# Altium project Dendro_hardware.PrjPcb
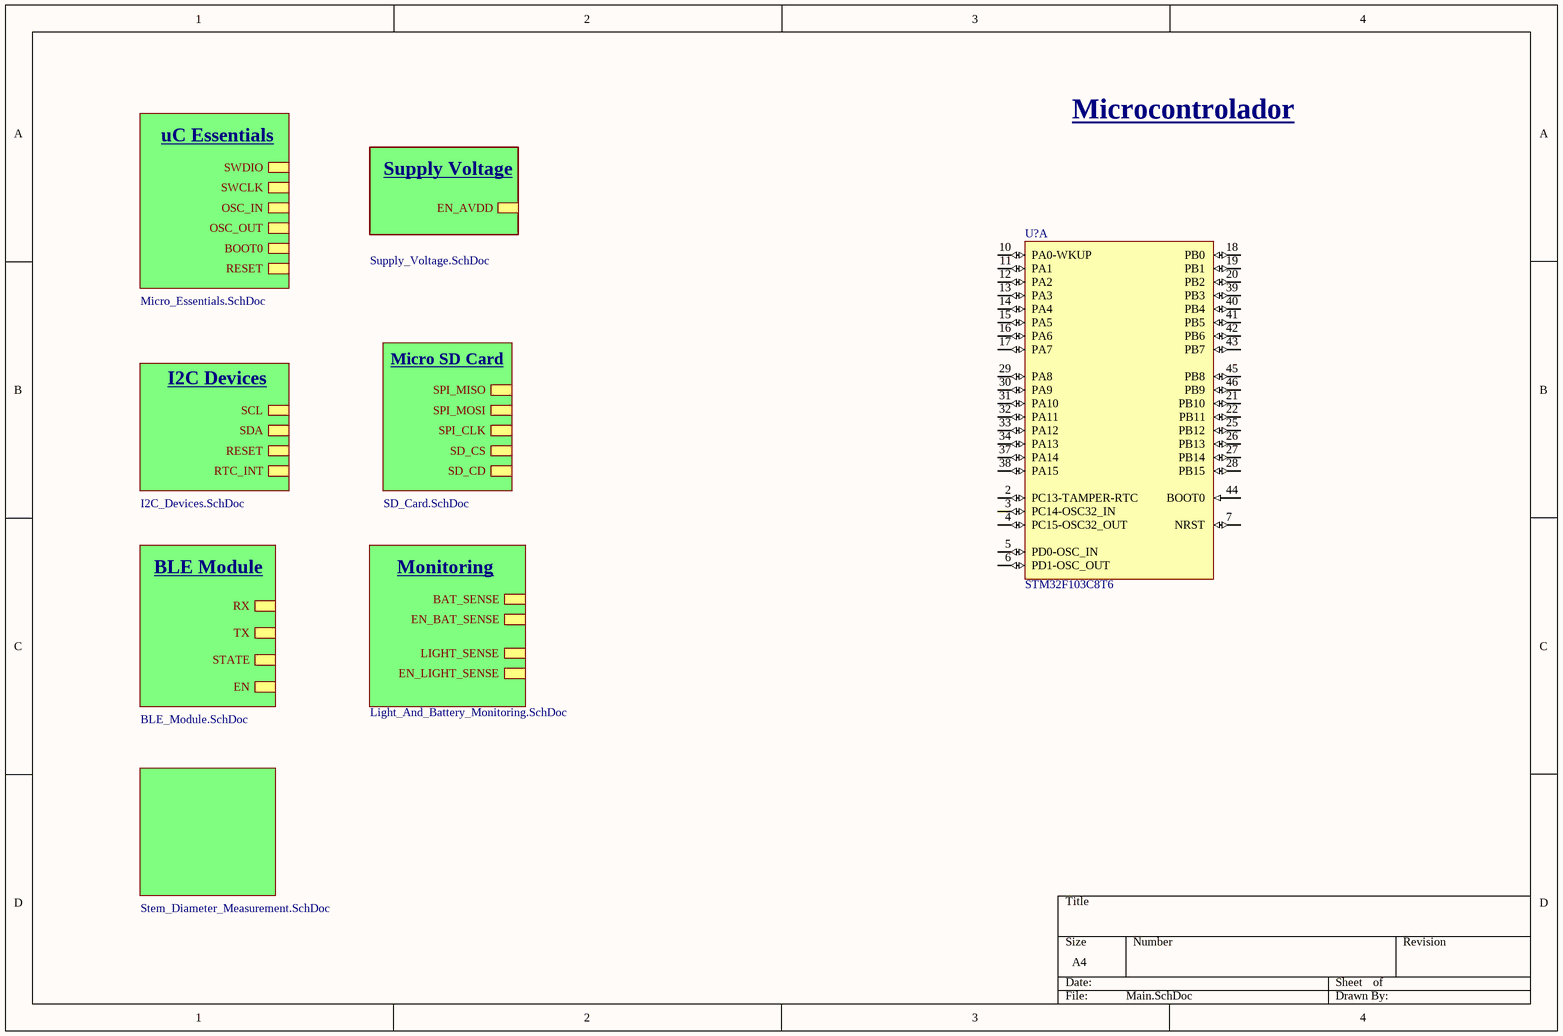
[diagram p0: Main.SchDoc]
8 sheets, 76 parts. Net scope: hierarchical (ports join the sheet entries above them; power ports are global).
Sheets:
  Main.SchDoc
    Micro_Essentials = Micro_Essentials.SchDoc
    Supply_Voltage = Supply_Voltage.SchDoc
    Real_Time_Clock = I2C_Devices.SchDoc
    SD_Card = SD_Card.SchDoc
    BLE_Module = BLE_Module.SchDoc
    Light_And_Battery_Monitoring = Light_And_Battery_Monitoring.SchDoc
    Stem_Diameter_Measurement = Stem_Diameter_Measurement.SchDoc

## Sheet Main.SchDoc
size A4; SheetNumber: 1; SheetTotal: 8

### Parts
(Parts that share a designator on the sheet are numbered #1, #2 ... from top to bottom, then left to right.)
U?#1  STM32F103C8T6  [STM-LQFP48_L]  (part A of 2)

### Sub-sheets
BLE_Module = BLE_Module.SchDoc: RX, TX, STATE, EN  | Titulo: BLE Module
Light_And_Battery_Monitoring = Light_And_Battery_Monitoring.SchDoc: BAT_SENSE, EN_BAT_SENSE, LIGHT_SENSE, EN_LIGHT_SENSE  | Titulo: Monitoring
Micro_Essentials = Micro_Essentials.SchDoc: RESET, BOOT0, OSC_OUT, OSC_IN, SWCLK, SWDIO  | Titulo: uC Essentials
Real_Time_Clock = I2C_Devices.SchDoc: SCL, SDA, RESET, RTC_INT  | Titulo: I2C Devices
SD_Card = SD_Card.SchDoc: SPI_MISO, SPI_MOSI, SPI_CLK, SD_CD, SD_CS  | Titulo: Micro SD Card
Stem_Diameter_Measurement = Stem_Diameter_Measurement.SchDoc: no entries
Supply_Voltage = Supply_Voltage.SchDoc: EN_AVDD  | Titulo: Supply Voltage

### Nets

Not connected (* = marked no-connect by the designer): U?#1 2(PC13-TAMPER-RTC) 3(PC14-OSC32_IN) 4(PC15-OSC32_OUT) 5(PD0-OSC_IN) 6(PD1-OSC_OUT) 7(NRST) 10(PA0-WKUP) 11(PA1) 12(PA2) 13(PA3) 14(PA4) 15(PA5) 16(PA6) 17(PA7) 18(PB0) 19(PB1) 20(PB2) 21(PB10) 22(PB11) 25(PB12) 26(PB13) 27(PB14) 28(PB15) 29(PA8) 30(PA9) 31(PA10) 32(PA11) 33(PA12) 34(PA13) 37(PA14) 38(PA15) 39(PB3) 40(PB4) 41(PB5) 42(PB6) 43(PB7) 44(BOOT0) 45(PB8) 46(PB9)

### Notes on the sheet
- Microcontrolador

### Library data of the parts
U?#1 = CMP-0237-00215-3: ARM Cortex-M3 32-bit MCU, 64 KB Flash, 20 KB Internal RAM, 37 I/Os, 48-pin LQFP, -40 to 85 degC, Tray; Supply Voltage(Vcc) min (V): 2; Internal RAM Size (kB): 20; FLASH Size (Prog) (kB): 64; A/D Converter: 2x12-bit (10 Channel); I/Os (High Current): 37; Operating Frequency(F) (Processor speed) (MHz): 72; Core: ARM Cortex-M3; ComponentLink3Description: Package Specification; Mounting Technology: Surface Mount; PartNumber: STM32F103C8T6; PackageReference: LQFP48; Packing: Tray; ComponentLink3URL: http://www.st.com/st-web-ui/static/active/en/resource/technical/document/datasheet/DM00058181.pdf; DatasheetVersion: Rev. 16; ComponentLink1URL: http://www.st.com/web/en/home.html; PackageVersion: Rev. 6, 06/2013; ComponentLink2URL: http://www.st.com/st-web-ui/static/active/en/resource/technical/document/datasheet/CD00161566.pdf; ComponentLink1Description: Manufacturer URL; ComponentLink2Description: Datasheet; PackageDescription: 48-Pin Low Profile Quad Flat Package, 7 x 7 mm Body, 0.5 mm Pitch

## Sheet Micro_Essentials.SchDoc
size A4; SheetNumber: 3; SheetTotal: 8
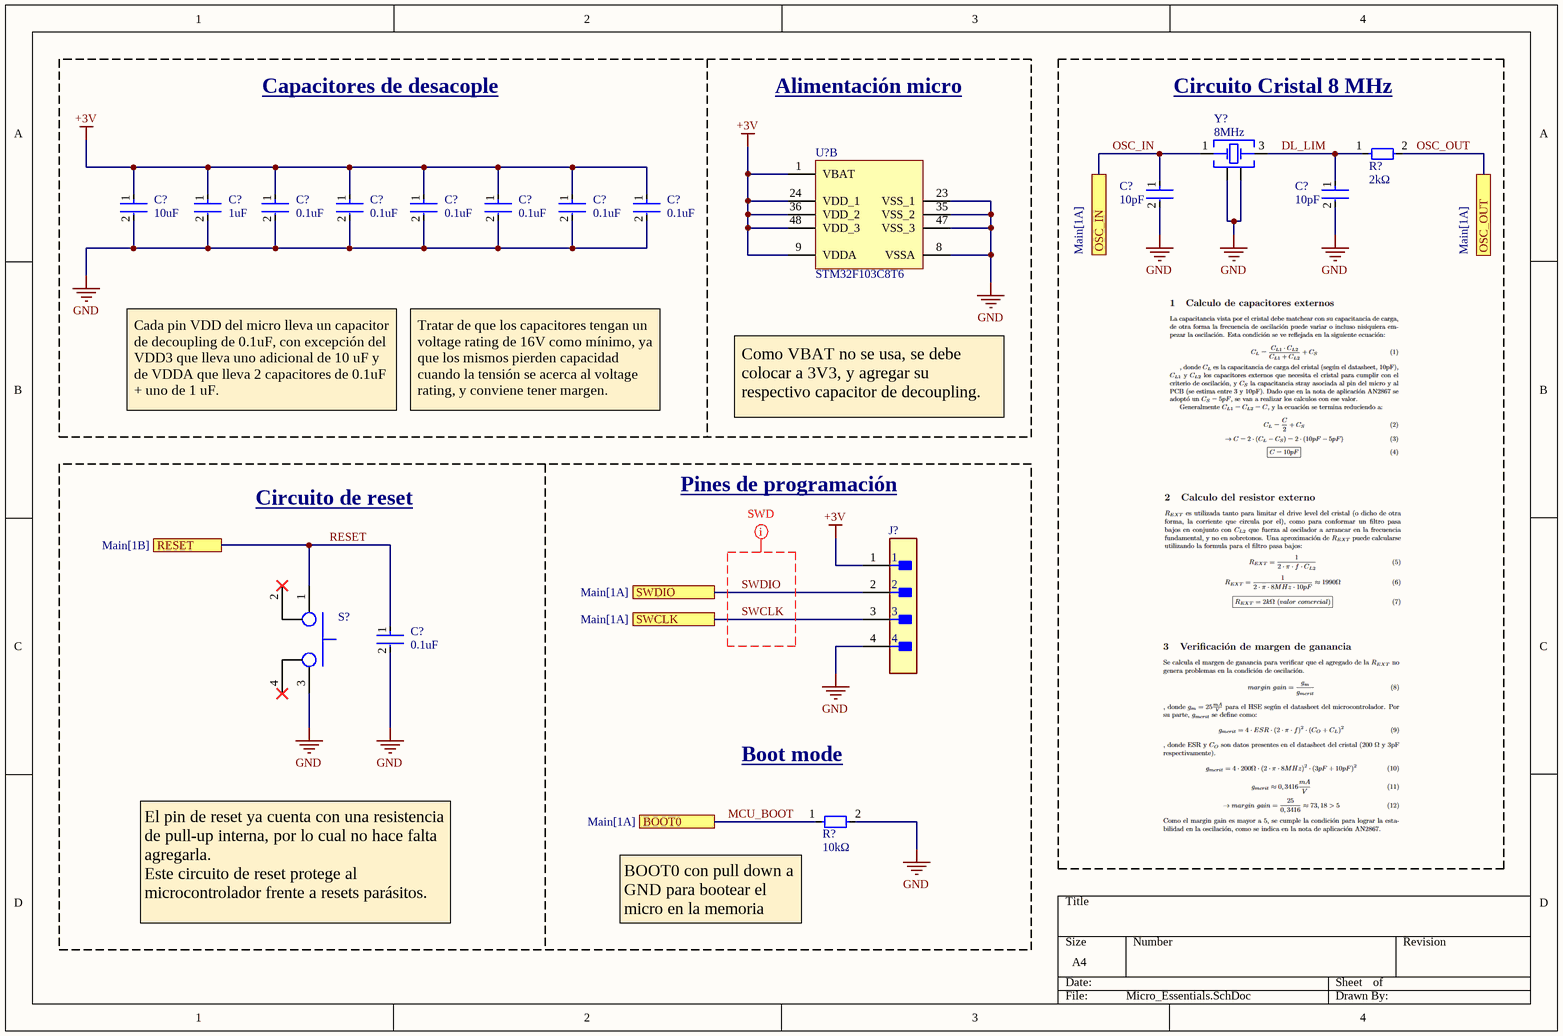
[diagram p1: Micro_Essentials.SchDoc]

### Parts
(Parts that share a designator on the sheet are numbered #1, #2 ... from top to bottom, then left to right.)
C?#1  Capacitance: 10pF  [FP-CL21-IPC_C]
C?#2  Capacitance: 10pF  [FP-CL21-IPC_C]
C?#3  Capacitance: 10uF  [FP-CL21-IPC_B]  (hidden comment: CL21A106KPFNNNE)
C?#4  Capacitance: 1uF  [FP-CL21-IPC_C]  (hidden comment: CL21B105KAFNNNG)
C?#5  Capacitance: 0.1uF  [FP-CL21-IPC_C]
C?#6  Capacitance: 0.1uF  [FP-CL21-IPC_C]
C?#7  Capacitance: 0.1uF  [FP-CL21-IPC_C]
C?#8  Capacitance: 0.1uF  [FP-CL21-IPC_C]
C?#9  Capacitance: 0.1uF  [FP-CL21-IPC_C]
C?#10  Capacitance: 0.1uF  [FP-CL21-IPC_C]
C?#11  Capacitance: 0.1uF  [FP-CL21-IPC_C]
J?#1  HTSW-104-07-G-S  [FP-HTSW-104-07-G-S-MFG]  (value not drawn)
R?#1  value 2kΩ  [PACKAGE_0805]  (hidden comment: Simbolo de resistencia genérica)
R?#2  value 10kΩ  [PACKAGE_0805]  (hidden comment: Simbolo de resistencia genérica)
S?  Tactile push button  [FP-B3W-1000-MFG]  (value not drawn)
U?#2  STM32F103C8T6  [STM-LQFP48_L]  (part B of 2)
Y?  Frequency: 8MHz  [WE-XTAL_12SMX]  (hidden comment: 830059082)

### Blocks framed on the sheet
Circuito Cristal 8 MHz: C?#1 C?#2 R?#1 Y?

### Ports
BOOT0 (see Main[1A]), OSC_IN (see Main[1A]), OSC_OUT (see Main[1A]), RESET (see Main[1B]), SWCLK (see Main[1A]), SWDIO (see Main[1A])

### Nets
+3V: C?#3.1 C?#4.1 C?#5.1 C?#6.1 C?#7.1 C?#8.1 C?#9.1 C?#10.1 J?#1.1 U?#2.1(VBAT) U?#2.9(VDDA) U?#2.24(VDD_1) U?#2.36(VDD_2) U?#2.48(VDD_3)
GND: C?#1.2 C?#2.2 C?#3.2 C?#4.2 C?#5.2 C?#6.2 C?#7.2 C?#8.2 C?#9.2 C?#10.2 C?#11.2 J?#1.4 R?#2.2 S?.3 U?#2.8(VSSA) U?#2.23(VSS_1) U?#2.35(VSS_2) U?#2.47(VSS_3) Y?.2(GND_&_Lid) Y?.4(GND_&_Lid)
DL_LIM: C?#2.1 R?#1.1 Y?.3(Crystal)
MCU_BOOT: R?#2.1 ; port BOOT0
OSC_IN: C?#1.1 Y?.1(Crystal) ; port OSC_IN
OSC_OUT: R?#1.2 ; port OSC_OUT
RESET: C?#11.1 S?.1 ; port RESET
SWCLK: J?#1.3 ; port SWCLK
SWDIO: J?#1.2 ; port SWDIO

Not connected (* = marked no-connect by the designer): S? 2* 4*

### Layout directives
net class SWD: SWCLK, SWDIO

### Notes on the sheet
- Capacitores de desacople
- Alimentación micro
- Cada pin VDD del micro lleva un capacitor de decoupling de 0.1uF, con excepción del VDD3 que lleva uno adicional de 10 uF y de VDDA que lleva 2 capacitores de 0.1uF + uno de 1 uF.
- Tratar de que los capacitores tengan un voltage rating de 16V como mínimo, ya que los mismos pierden capacidad cuando la tensión se acerca al voltage rating, y conviene tener margen.
- Como VBAT no se usa, se debe colocar a 3V3, y agregar su respectivo capacitor de decoupling.
- Circuito de reset
- Pines de programación
- Boot mode
- El pin de reset ya cuenta con una resistencia de pull-up interna, por lo cual no hace falta agregarla.
  Este circuito de reset protege al microcontrolador frente a resets parásitos.
- (near R?#2) BOOT0 con pull down a GND para bootear el micro en la memoria flash principal.

### Library data of the parts
C?#1 C?#2 C?#5-C?#11 = CMP-13271-003813-1: 0805 0.1uF 25V ±10% Tolerance X7R Multilayer Ceramic Chip Capacitor; Case Code (Imperial): 0805; Length: 2mm; Max Operating Temperature: 125°C; Tolerance: 10%; Depth: 1.25mm; Package Quantity: 3000; Material: Ceramic; Voltage Rating: 25V; Height: 1.25mm; Mount: Surface Mount; Dielectric: X7R; Packaging: Tape and Reel; Voltage: 25V; Case/Package: 0805; Radiation Hardening: No; Thickness: 0.053inch; Width: 0.049inch; Min Operating Temperature: -55°C; Case Code (Metric): 2012
C?#3 = CMP-2000-06103-2: CL21 Series 0805 10uF 10V ±10% Tolerance X5R Multilayer Ceramic Chip Capacitor; Case Code (Imperial): 0805; Mount: Surface Mount; Depth: 1.25mm; Length: 2mm; Lead Free: Lead Free; Packaging: Tape and Reel; Dielectric: X5R; Width: 0.049inch; Package Quantity: 1; Height: 1.25mm; Case/Package: 0805; Voltage Rating: 10V; Thickness: 0.053inch; Max Operating Temperature: 85°C; Tolerance: 10%; Case Code (Metric): 2012; Contact Plating: Tin; Min Operating Temperature: -55°C; Radiation Hardening: No; Voltage Rating (DC): 10V
C?#4 = CMP-13271-003813-1: CL21 Series 0805 1uF 25V ±10% Tolerance X7R Multilayer Ceramic Chip Capacitor; Case Code (Imperial): 0805; Length: 2mm; Max Operating Temperature: 125°C; Tolerance: 10%; Depth: 1.25mm; Package Quantity: 3000; Material: Ceramic; Voltage Rating: 25V; Height: 1.25mm; Mount: Surface Mount; Dielectric: X7R; Packaging: Tape and Reel; Voltage: 25V; Case/Package: 0805; Radiation Hardening: No; Thickness: 0.053inch; Width: 0.049inch; Min Operating Temperature: -55°C; Case Code (Metric): 2012
J?#1 = CMP-02766-001776-1: CONN HEADER VERT 4POS 2.54MM; Gender: Male; Number of Contacts: 4; Packaging: Bulk; RoHS Compliant: Yes; Number of Rows: 1; Mount: Through Hole; Contact Material: Bronze; Series: HTSW; Radiation Hardening: No; Pitch: 2.54mm; Reach SVHC Compliant: Yes; Contact Plating: Gold; Termination: Through Hole
R?#1 R?#2 = Generic R
U?#2 = CMP-0237-00215-3: as U?#1 on sheet Main; Core: ARM Cortex-M3; ComponentLink3Description: Package Specification; Mounting Technology: Surface Mount; PartNumber: STM32F103C8T6; PackageReference: LQFP48; Packing: Tray; ComponentLink3URL: http://www.st.com/st-web-ui/static/active/en/resource/technical/document/datasheet/DM00058181.pdf; DatasheetVersion: Rev. 16; ComponentLink1URL: http://www.st.com/web/en/home.html; PackageVersion: Rev. 6, 06/2013; ComponentLink2URL: http://www.st.com/st-web-ui/static/active/en/resource/technical/document/datasheet/CD00161566.pdf; ComponentLink1Description: Manufacturer URL; ComponentLink2Description: Datasheet; PackageDescription: 48-Pin Low Profile Quad Flat Package, 7 x 7 mm Body, 0.5 mm Pitch
Y? = CMP-03913-116855696-1: 830059082 WE-XTAL Quartz Crystal; Length: 7mm; Min Operating Temperature: -20°C; NexarPartId: 116855696; Max Operating Temperature: 70°C; Width: 5mm; Height: 1.4mm

## Sheet Supply_Voltage.SchDoc
size A4; SheetNumber: 2; SheetTotal: 8
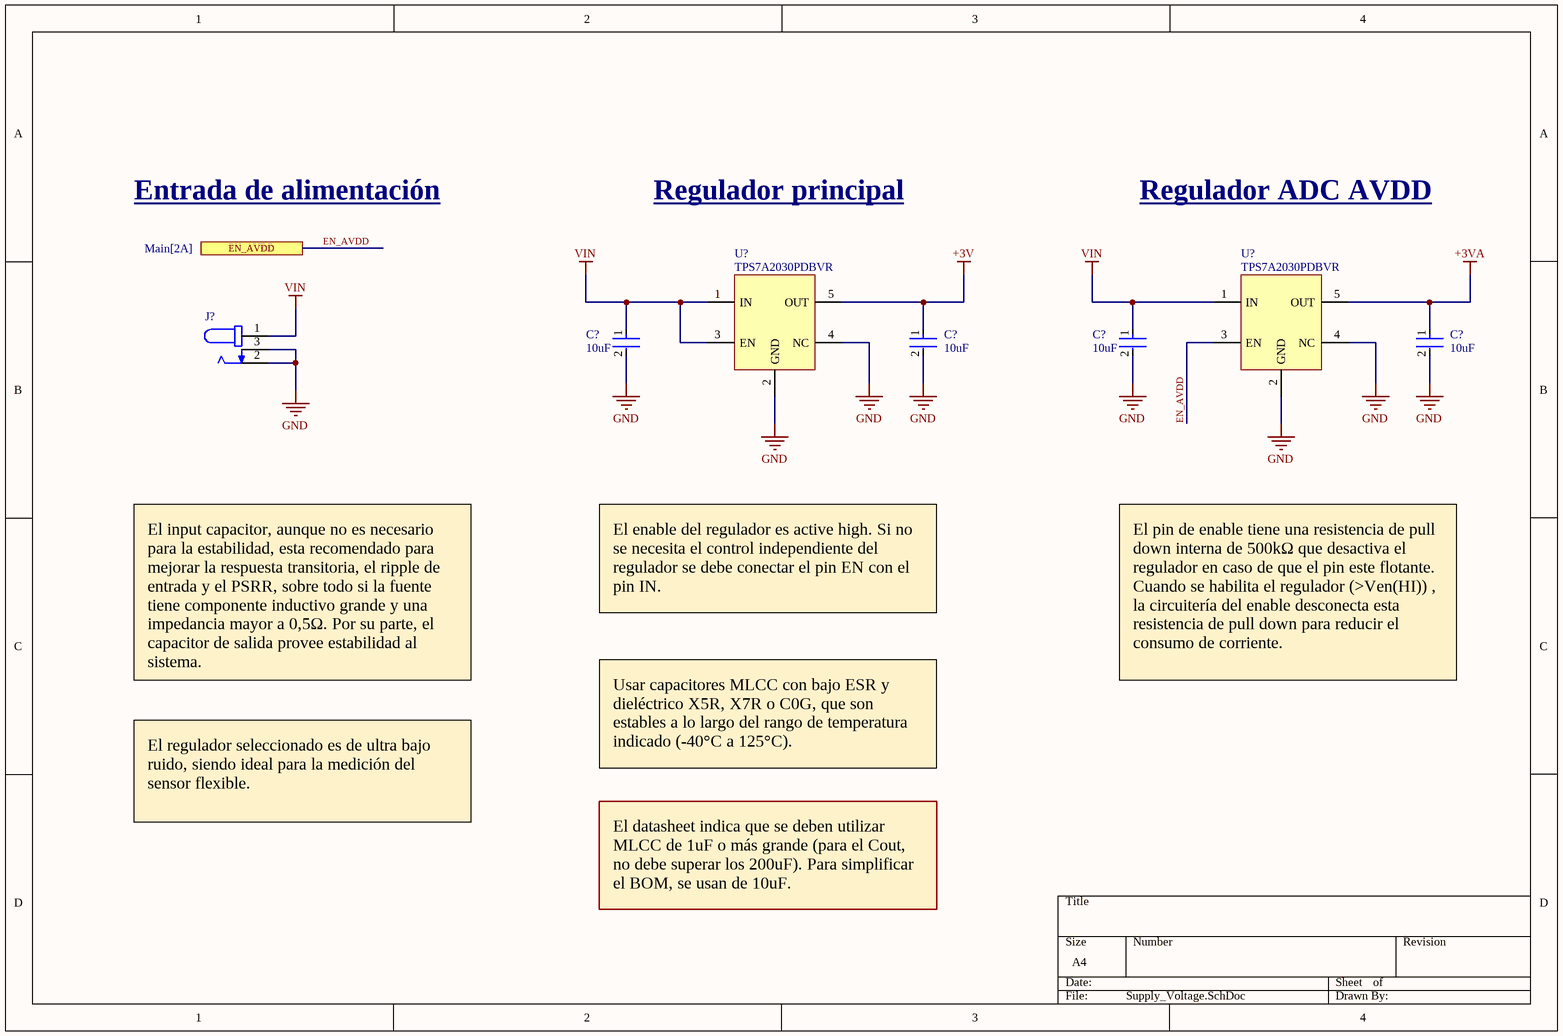
[diagram p2: Supply_Voltage.SchDoc]

### Parts
(Parts that share a designator on the sheet are numbered #1, #2 ... from top to bottom, then left to right.)
C?#12  Capacitance: 10uF  [FP-CL21-IPC_B]  (hidden comment: CL21A106KPFNNNE)
C?#13  Capacitance: 10uF  [FP-CL21-IPC_B]  (hidden comment: CL21A106KPFNNNE)
C?#14  Capacitance: 10uF  [FP-CL21-IPC_B]  (hidden comment: CL21A106KPFNNNE)
C?#15  Capacitance: 10uF  [FP-CL21-IPC_B]  (hidden comment: CL21A106KPFNNNE)
J?#2  DCJ200-10-A-XX-K_REVA  [GCT_DCJ200-10-A-XX-K_REVA]  (value not drawn)
U?#3  TPS7A2030PDBVR  [SOT-23 Texas]
U?#4  TPS7A2030PDBVR  [SOT-23 Texas]

### Ports
EN_AVDD (see Main[2A])

### Nets
+3V: C?#13.1 U?#3.5(OUT)
+3VA: C?#15.1 U?#4.5(OUT)
GND: C?#12.2 C?#13.2 C?#14.2 C?#15.2 J?#2.2 J?#2.3 U?#3.2(GND) U?#3.4(NC) U?#4.2(GND) U?#4.4(NC)
VIN: C?#12.1 C?#14.1 J?#2.1 U?#3.1(IN) U?#3.3(EN) U?#4.1(IN)
EN_AVDD: U?#4.3(EN) ; port EN_AVDD

### Notes on the sheet
- Entrada de alimentación
- Regulador principal
- Regulador ADC AVDD
- El enable del regulador es active high. Si no se necesita el control independiente del regulador se debe conectar el pin EN con el pin IN.
- El input capacitor, aunque no es necesario para la estabilidad, esta recomendado para mejorar la respuesta transitoria, el ripple de entrada y el PSRR, sobre todo si la fuente tiene componente inductivo grande y una impedancia mayor a 0,5Ω. Por su parte, el capacitor de salida provee estabilidad al sistema.
  Ambos capacitores deben ser de 1uF o mayores. En este caso se elige 10uF para simplificar el BOM.
- El pin de enable tiene una resistencia de pull down interna de 500kΩ que desactiva el regulador en caso de que el pin este flotante. Cuando se habilita el regulador (>Ven(HI)) , la circuitería del enable desconecta esta resistencia de pull down para reducir el consumo de corriente.
- Usar capacitores MLCC con bajo ESR y  dieléctrico X5R, X7R o C0G, que son estables a lo largo del rango de temperatura indicado (-40°C a 125°C).
- El regulador seleccionado es de ultra bajo ruido, siendo ideal para la medición del sensor flexible.
- El datasheet indica que se deben utilizar MLCC de 1uF o más grande (para el Cout, no debe superar los 200uF). Para simplificar el BOM, se usan de 10uF.

### Library data of the parts
C?#12-C?#15 = CMP-2000-06103-2: as C?#3 on sheet Micro_Essentials; Case Code (Imperial): 0805; Mount: Surface Mount; Depth: 1.25mm; Length: 2mm; Lead Free: Lead Free; Packaging: Tape and Reel; Dielectric: X5R; Width: 0.049inch; Package Quantity: 1; Height: 1.25mm; Case/Package: 0805; Voltage Rating: 10V; Thickness: 0.053inch; Max Operating Temperature: 85°C; Tolerance: 10%; Case Code (Metric): 2012; Contact Plating: Tin; Min Operating Temperature: -55°C; Radiation Hardening: No; Voltage Rating (DC): 10V
J?#2 = DCJ200-10-A-XX-K_REVA: Power Barrel Connector Jack 2.05mm ID (0.081), 5.50mm OD (0.217) Through Hole, Right Angle; MF: Global Connector Technology; MP: DCJ200-10-A-K1-K; SnapEDA_Link: https://www.snapeda.com/parts/DCJ200-10-A-K1-K/Global+Connector+Technology/view-part/?ref=snap; Package: None; Value: *; Check_prices: https://www.snapeda.com/parts/DCJ200-10-A-K1-K/Global+Connector+Technology/view-part/?ref=eda
U?#3 U?#4 = TPS7A2030PDBVR: IC REG LINEAR 3.3V 300MA SOT23-5

## Sheet I2C_Devices.SchDoc
size A4; SheetNumber: 4; SheetTotal: 8
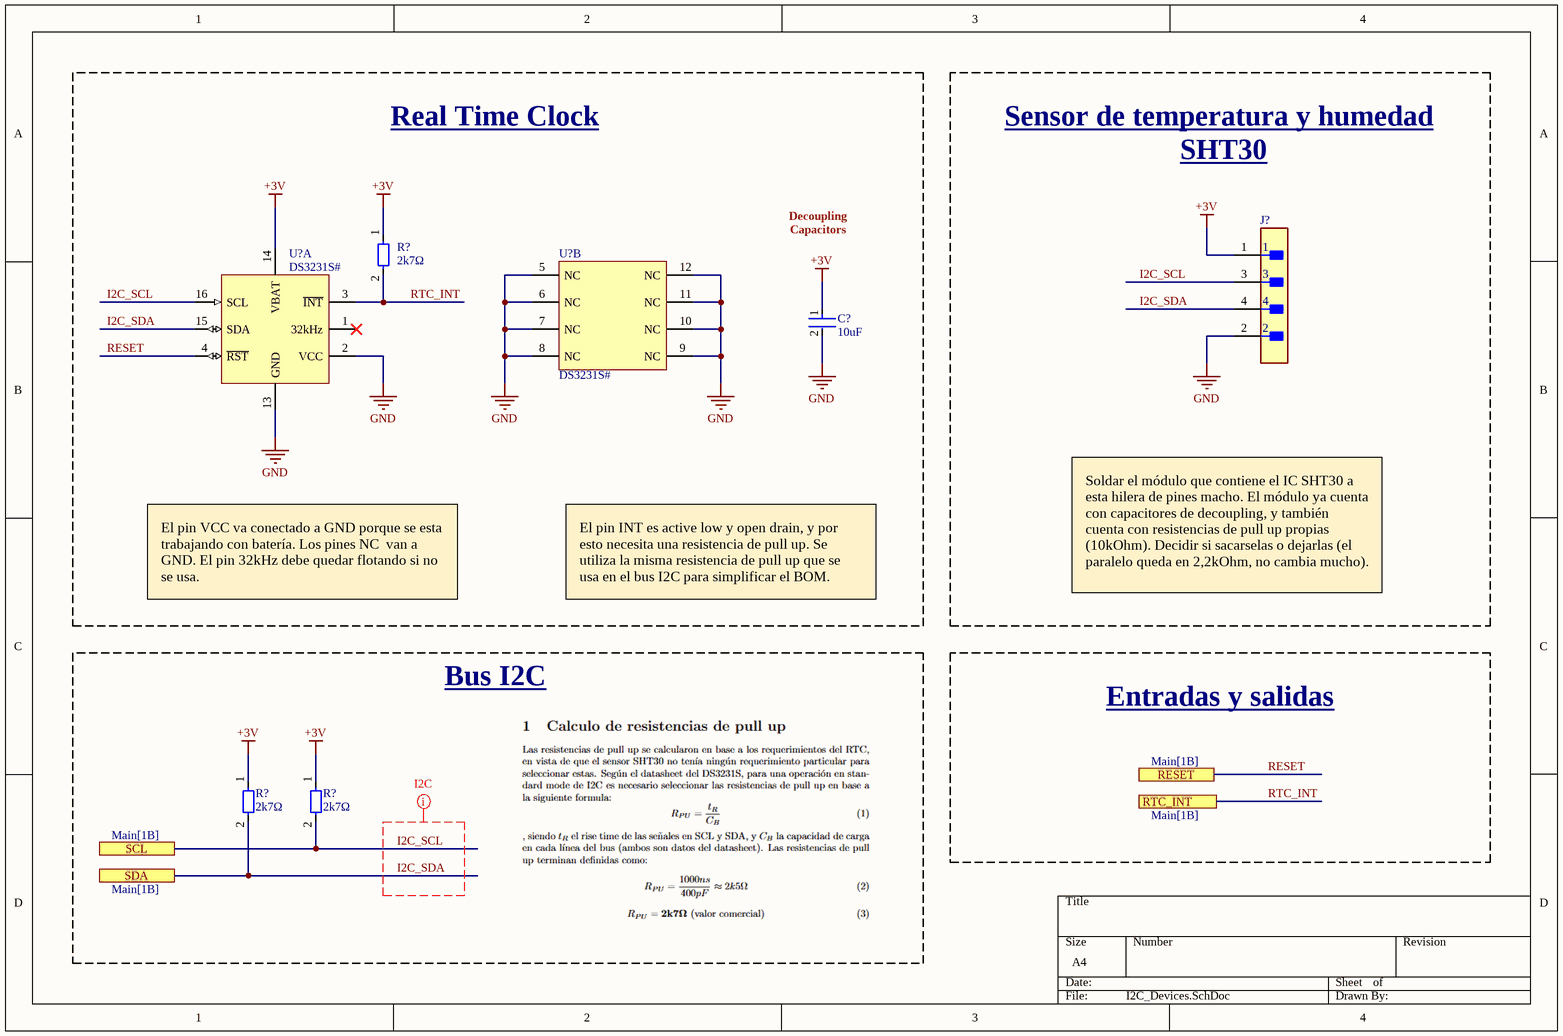
[diagram p3: I2C_Devices.SchDoc]

### Parts
(Parts that share a designator on the sheet are numbered #1, #2 ... from top to bottom, then left to right.)
C?#16  Capacitance: 10uF  [FP-CL21-IPC_B]  (hidden comment: CL21A106KPFNNNE)
J?#3  HTSW-104-07-G-S  [FP-HTSW-104-07-G-S-MFG]  (value not drawn)
R?#3  value 2k7Ω  [PACKAGE_0805]  (hidden comment: Simbolo de resistencia genérica)
R?#4  value 2k7Ω  [PACKAGE_0805]  (hidden comment: Simbolo de resistencia genérica)
R?#5  value 2k7Ω  [PACKAGE_0805]  (hidden comment: Simbolo de resistencia genérica)
U?#5  DS3231S#  [W16-H2_M]  (part B of 2)
U?#6  DS3231S#  [W16-H2_M]  (part A of 2)

### Blocks framed on the sheet
Real Time Clock: C?#16 R?#3 U?#5 U?#6
Bus I2C: R?#4 R?#5

### Ports
RESET (see Main[1B]), RTC_INT (see Main[1B]), SCL (see Main[1B]), SDA (see Main[1B])

### Nets
+3V: C?#16.1 J?#3.1 R?#3.1 R?#4.1 R?#5.1 U?#6.14(VBAT)
GND: C?#16.2 J?#3.2 U?#5.5(NC) U?#5.6(NC) U?#5.7(NC) U?#5.8(NC) U?#5.9(NC) U?#5.10(NC) U?#5.11(NC) U?#5.12(NC) U?#6.2(VCC) U?#6.13(GND)
I2C_SCL: J?#3.3 R?#5.2 U?#6.16(SCL) ; port SCL
I2C_SDA: J?#3.4 R?#4.2 U?#6.15(SDA) ; port SDA
RESET: U?#6.4(~{RST}) ; port RESET
RTC_INT: R?#3.2 U?#6.3(~{INT}) ; port RTC_INT

Not connected (* = marked no-connect by the designer): U?#6 1(32kHz)*

### Layout directives
net class I2C: I2C_SCL, I2C_SDA

### Notes on the sheet
- Sensor de temperatura y humedad
- SHT30
- Decoupling
  Capacitors
- El pin VCC va conectado a GND porque se esta trabajando con batería. Los pines NC  van a GND. El pin 32kHz debe quedar flotando si no se usa.
- El pin INT es active low y open drain, y por esto necesita una resistencia de pull up. Se utiliza la misma resistencia de pull up que se usa en el bus I2C para simplificar el BOM.
- Soldar el módulo que contiene el IC SHT30 a esta hilera de pines macho. El módulo ya cuenta con capacitores de decoupling, y también cuenta con resistencias de pull up propias (10kOhm). Decidir si sacarselas o dejarlas (el paralelo queda en 2,2kOhm, no cambia mucho).
- Entradas y salidas

### Library data of the parts
C?#16 = CMP-2000-06103-2: as C?#3 on sheet Micro_Essentials; Case Code (Imperial): 0805; Mount: Surface Mount; Depth: 1.25mm; Length: 2mm; Lead Free: Lead Free; Packaging: Tape and Reel; Dielectric: X5R; Width: 0.049inch; Package Quantity: 1; Height: 1.25mm; Case/Package: 0805; Voltage Rating: 10V; Thickness: 0.053inch; Max Operating Temperature: 85°C; Tolerance: 10%; Case Code (Metric): 2012; Contact Plating: Tin; Min Operating Temperature: -55°C; Radiation Hardening: No; Voltage Rating (DC): 10V
J?#3 = CMP-02766-001776-1: as J?#1 on sheet Micro_Essentials; Packaging: Bulk; RoHS Compliant: Yes; Number of Rows: 1; Mount: Through Hole; Contact Material: Bronze; Series: HTSW; Radiation Hardening: No; Pitch: 2.54mm; Reach SVHC Compliant: Yes; Contact Plating: Gold; Termination: Through Hole
R?#3-R?#5 = Generic R
U?#5 U?#6 = DS3231S# for battery use: IC RTC CLK/CALENDAR I2C 16SOIC. Symbol used with battery as the main supply voltage.

## Sheet SD_Card.SchDoc
size A4; SheetNumber: 5; SheetTotal: 8
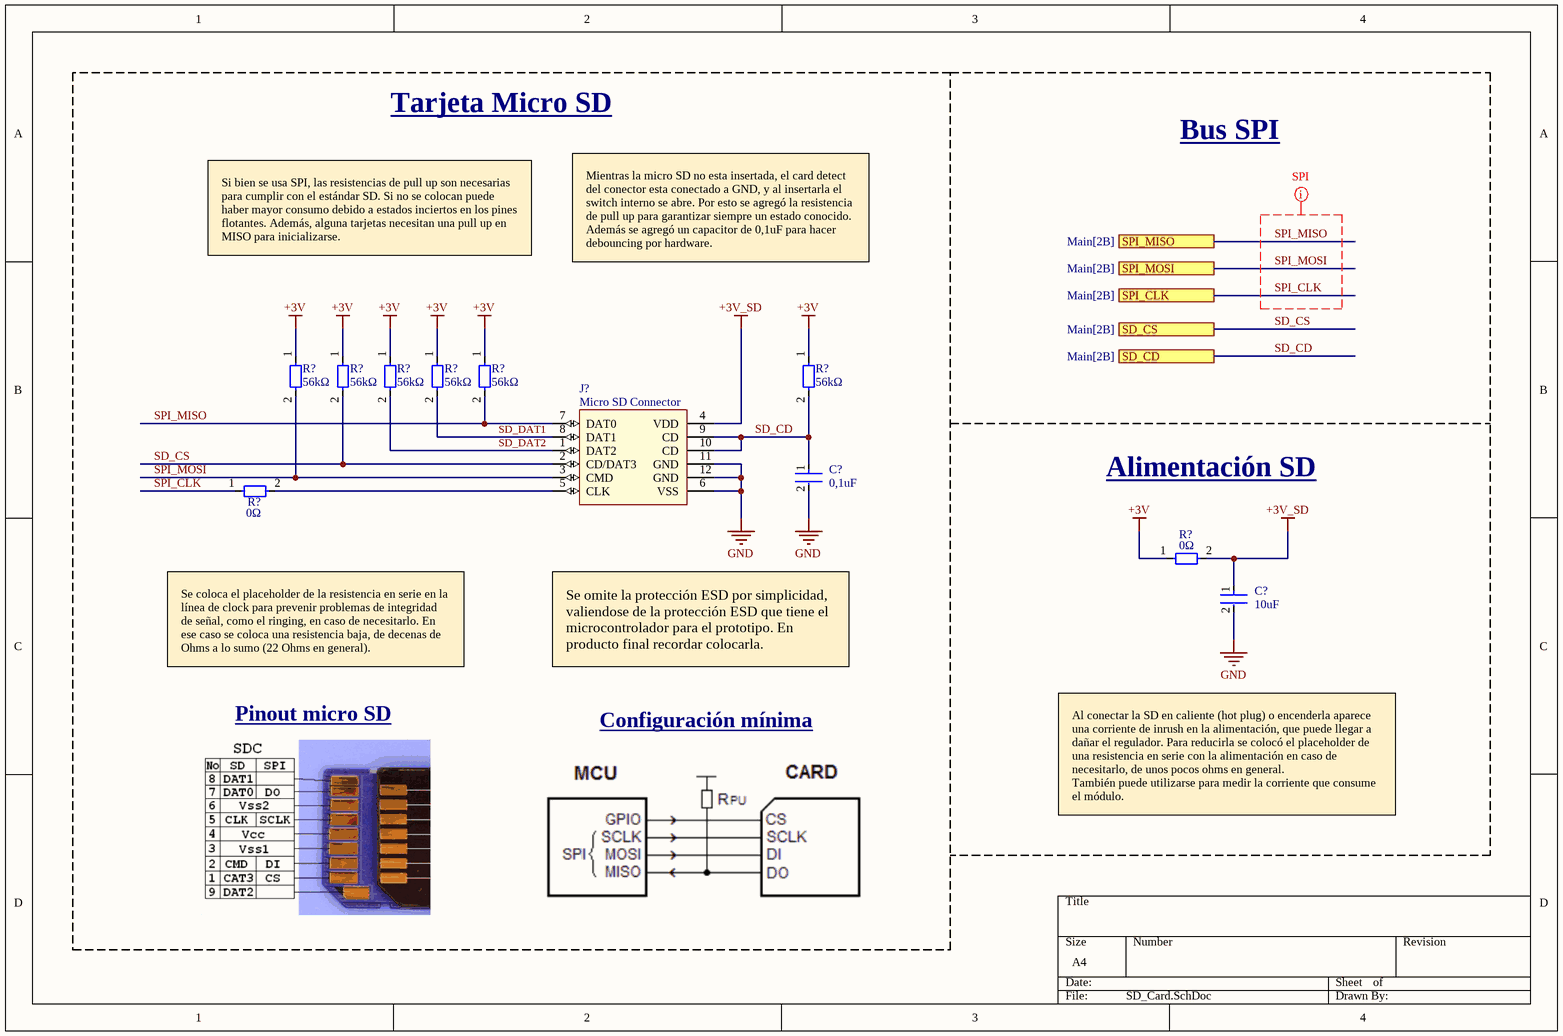
[diagram p4: SD_Card.SchDoc]

### Parts
(Parts that share a designator on the sheet are numbered #1, #2 ... from top to bottom, then left to right.)
C?#17  Capacitance: 0,1uF  [FP-CL21-IPC_B]  (hidden comment: CL21A106KPFNNNE)
C?#18  Capacitance: 10uF  [FP-CL21-IPC_B]  (hidden comment: CL21A106KPFNNNE)
J?#4  Micro SD Connector  [MEM2061-01-188-00-A_revA]
R?#6  value 56kΩ  [PACKAGE_0805]  (hidden comment: Simbolo de resistencia genérica)
R?#7  value 56kΩ  [PACKAGE_0805]  (hidden comment: Simbolo de resistencia genérica)
R?#8  value 56kΩ  [PACKAGE_0805]  (hidden comment: Simbolo de resistencia genérica)
R?#9  value 56kΩ  [PACKAGE_0805]  (hidden comment: Simbolo de resistencia genérica)
R?#10  value 56kΩ  [PACKAGE_0805]  (hidden comment: Simbolo de resistencia genérica)
R?#11  value 56kΩ  [PACKAGE_0805]  (hidden comment: Simbolo de resistencia genérica)
R?#12  value 0Ω  [PACKAGE_0805]  (hidden comment: Simbolo de resistencia genérica)
R?#13  value 0Ω  [PACKAGE_0805]  (hidden comment: Simbolo de resistencia genérica)

### Blocks framed on the sheet
Tarjeta Micro SD: C?#17 J?#4 R?#6-R?#12

### Ports
SD_CD (see Main[2B]), SD_CS (see Main[2B]), SPI_CLK (see Main[2B]), SPI_MISO (see Main[2B]), SPI_MOSI (see Main[2B])

### Nets
+3V: R?#6.1 R?#7.1 R?#8.1 R?#9.1 R?#10.1 R?#11.1 R?#13.1
+3V_SD: C?#18.1 J?#4.4(VDD) R?#13.2
GND: C?#17.2 C?#18.2 J?#4.6(VSS) J?#4.11(GND) J?#4.12(GND)
SD_CD: C?#17.1 J?#4.9(CD) J?#4.10(CD) R?#11.2 ; port SD_CD
SD_CS: J?#4.2(CD/DAT3) R?#7.2 ; port SD_CS
SD_DAT1: J?#4.8(DAT1) R?#9.2
SD_DAT2: J?#4.1(DAT2) R?#8.2
SPI_CLK: R?#12.1 ; port SPI_CLK
SPI_MISO: J?#4.7(DAT0) R?#10.2 ; port SPI_MISO
SPI_MOSI: J?#4.3(CMD) R?#6.2 ; port SPI_MOSI
NetJ?#4_5: J?#4.5(CLK) R?#12.2

### Layout directives
net class SPI: SPI_CLK, SPI_MISO, SPI_MOSI

### Notes on the sheet
- Bus SPI
- Si bien se usa SPI, las resistencias de pull up son necesarias para cumplir con el estándar SD. Si no se colocan puede haber mayor consumo debido a estados inciertos en los pines flotantes. Además, alguna tarjetas necesitan una pull up en MISO para inicializarse.
- Mientras la micro SD no esta insertada, el card detect del conector esta conectado a GND, y al insertarla el switch interno se abre. Por esto se agregó la resistencia de pull up para garantizar siempre un estado conocido. Además se agregó un capacitor de 0,1uF para hacer debouncing por hardware.
- Alimentación SD
- Se coloca el placeholder de la resistencia en serie en la línea de clock para prevenir problemas de integridad de señal, como el ringing, en caso de necesitarlo. En ese caso se coloca una resistencia baja, de decenas de Ohms a lo sumo (22 Ohms en general).
- Se omite la protección ESD por simplicidad, valiendose de la protección ESD que tiene el microcontrolador para el prototipo. En producto final recordar colocarla.
- Pinout micro SD
- Configuración mínima
- Al conectar la SD en caliente (hot plug) o encenderla aparece una corriente de inrush en la alimentación, que puede llegar a dañar el regulador. Para reducirla se colocó el placeholder de una resistencia en serie con la alimentación en caso de necesitarlo, de unos pocos ohms en general.
  También puede utilizarse para medir la corriente que consume el módulo.

### Library data of the parts
C?#17 C?#18 = CMP-2000-06103-2: as C?#3 on sheet Micro_Essentials; Case Code (Imperial): 0805; Mount: Surface Mount; Depth: 1.25mm; Length: 2mm; Lead Free: Lead Free; Packaging: Tape and Reel; Dielectric: X5R; Width: 0.049inch; Package Quantity: 1; Height: 1.25mm; Case/Package: 0805; Voltage Rating: 10V; Thickness: 0.053inch; Max Operating Temperature: 85°C; Tolerance: 10%; Case Code (Metric): 2012; Contact Plating: Tin; Min Operating Temperature: -55°C; Radiation Hardening: No; Voltage Rating (DC): 10V
J?#4 = MEM2061-01-188-00-A_revA: Micro SD Memory Card Connector, 1.88mm Profile SMT,Push Push, with normally closed switch. MEM2061-01-188-00-A_revA
R?#6-R?#13 = Generic R

## Sheet BLE_Module.SchDoc
size A4; SheetNumber: 6; SheetTotal: 8
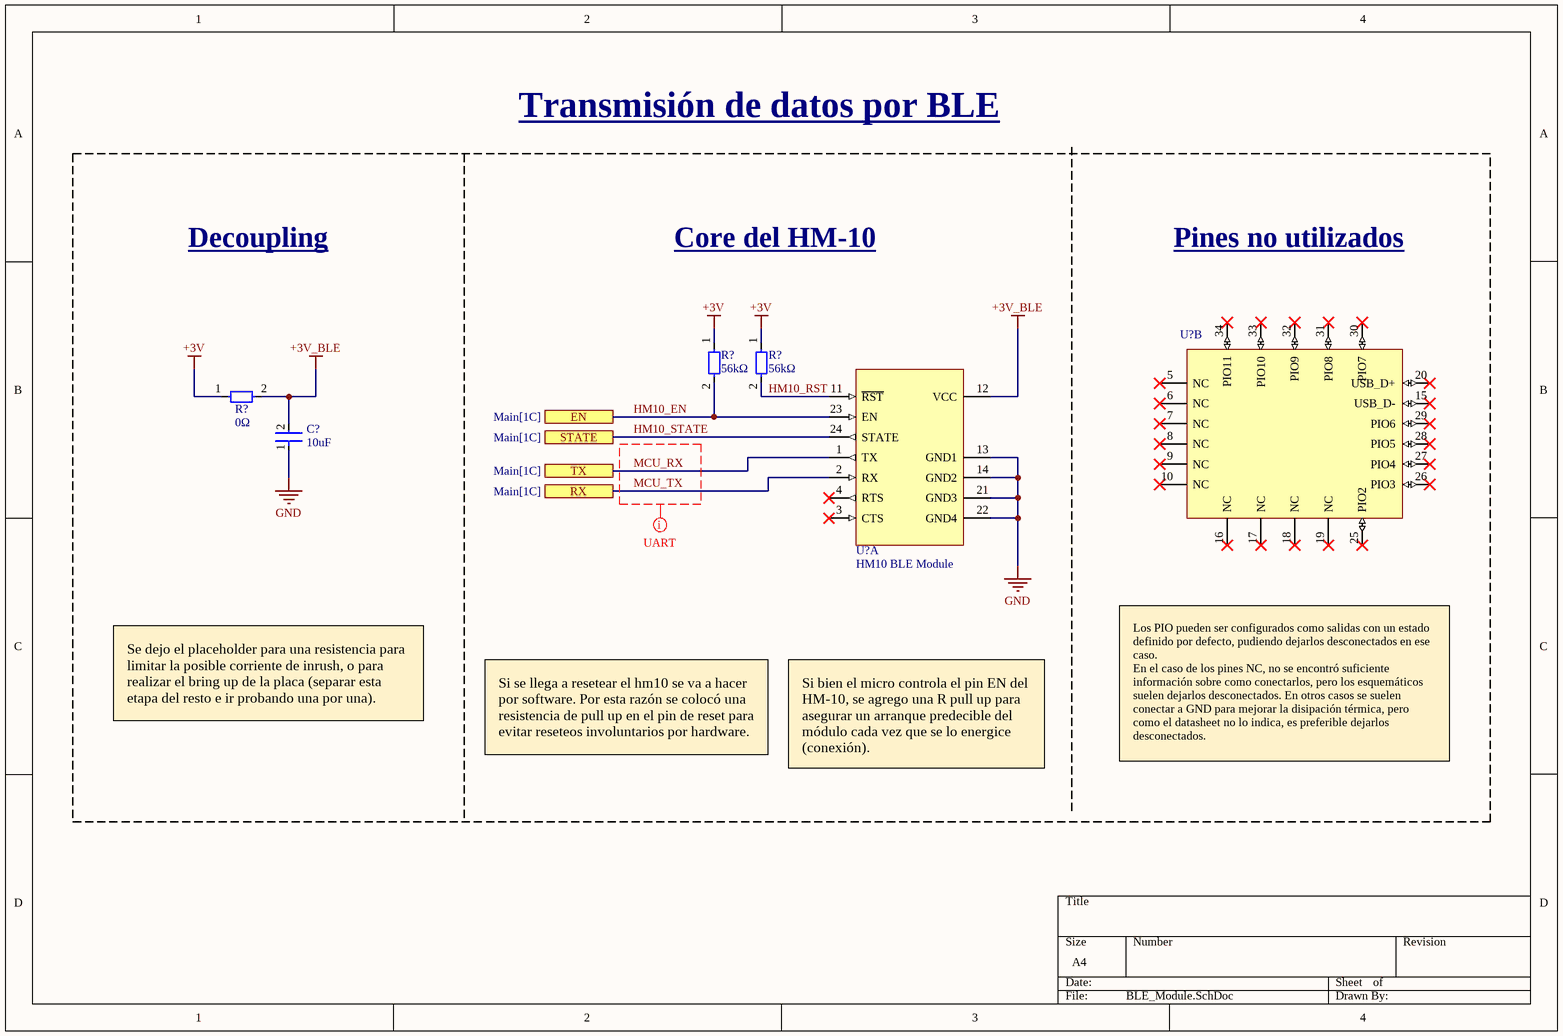
[diagram p5: BLE_Module.SchDoc]

### Parts
(Parts that share a designator on the sheet are numbered #1, #2 ... from top to bottom, then left to right.)
C?#19  Capacitance: 10uF  [FP-CL21-IPC_B]  (hidden comment: CL21A106KPFNNNE)
R?#14  value 56kΩ  [PACKAGE_0805]  (hidden comment: Simbolo de resistencia genérica)
R?#15  value 56kΩ  [PACKAGE_0805]  (hidden comment: Simbolo de resistencia genérica)
R?#16  value 0Ω  [PACKAGE_0805]  (hidden comment: Simbolo de resistencia genérica)
U?#7  HM10 BLE Module  [HM10_FOOTPRINT]  (part A of 2)
U?#8  HM10 BLE Module  [HM10_FOOTPRINT]  (value not drawn)  (part B of 2)

### Ports
EN (see Main[1C]), RX (see Main[1C]), STATE (see Main[1C]), TX (see Main[1C])

### Nets
+3V: R?#14.1 R?#15.1 R?#16.1
+3V_BLE: C?#19.2 R?#16.2 U?#7.12(VCC)
GND: C?#19.1 U?#7.13(GND1) U?#7.14(GND2) U?#7.21(GND3) U?#7.22(GND4)
HM10_EN: R?#14.2 U?#7.23(EN) ; port EN
HM10_RST: R?#15.2 U?#7.11(~{RST})
HM10_STATE: U?#7.24(STATE) ; port STATE
MCU_RX: U?#7.1(TX) ; port TX
MCU_TX: U?#7.2(RX) ; port RX

Not connected (* = marked no-connect by the designer): U?#7 3(CTS)* 4(RTS)*; U?#8 5(NC)* 6(NC)* 7(NC)* 8(NC)* 9(NC)* 10(NC)* 15(USB_D-)* 16(NC)* 17(NC)* 18(NC)* 19(NC)* 20(USB_D+)* 25(PIO2)* 26(PIO3)* 27(PIO4)* 28(PIO5)* 29(PIO6)* 30(PIO7)* 31(PIO8)* 32(PIO9)* 33(PIO10)* 34(PIO11)*

### Layout directives
net class UART: MCU_RX, MCU_TX

### Notes on the sheet
- Transmisión de datos por BLE
- Decoupling
- Core del HM-10
- Pines no utilizados
- Se dejo el placeholder para una resistencia para limitar la posible corriente de inrush, o para realizar el bring up de la placa (separar esta etapa del resto e ir probando una por una).
- Si se llega a resetear el hm10 se va a hacer por software. Por esta razón se colocó una resistencia de pull up en el pin de reset para evitar reseteos involuntarios por hardware.
- Si bien el micro controla el pin EN del HM-10, se agrego una R pull up para asegurar un arranque predecible del módulo cada vez que se lo energice (conexión).
- Los PIO pueden ser configurados como salidas con un estado definido por defecto, pudiendo dejarlos desconectados en ese caso.
  En el caso de los pines NC, no se encontró suficiente información sobre como conectarlos, pero los esquemáticos suelen dejarlos desconectados. En otros casos se suelen conectar a GND para mejorar la disipación térmica, pero como el datasheet no lo indica, es preferible dejarlos desconectados.

### Library data of the parts
C?#19 = CMP-2000-06103-2: as C?#3 on sheet Micro_Essentials; Case Code (Imperial): 0805; Mount: Surface Mount; Depth: 1.25mm; Length: 2mm; Lead Free: Lead Free; Packaging: Tape and Reel; Dielectric: X5R; Width: 0.049inch; Package Quantity: 1; Height: 1.25mm; Case/Package: 0805; Voltage Rating: 10V; Thickness: 0.053inch; Max Operating Temperature: 85°C; Tolerance: 10%; Case Code (Metric): 2012; Contact Plating: Tin; Min Operating Temperature: -55°C; Radiation Hardening: No; Voltage Rating (DC): 10V
R?#14-R?#16 = Generic R
U?#7 U?#8 = HM10: Modulo BLE HM10 con castellated pads.

## Sheet Light_And_Battery_Monitoring.SchDoc
size A4; SheetNumber: 7; SheetTotal: 8
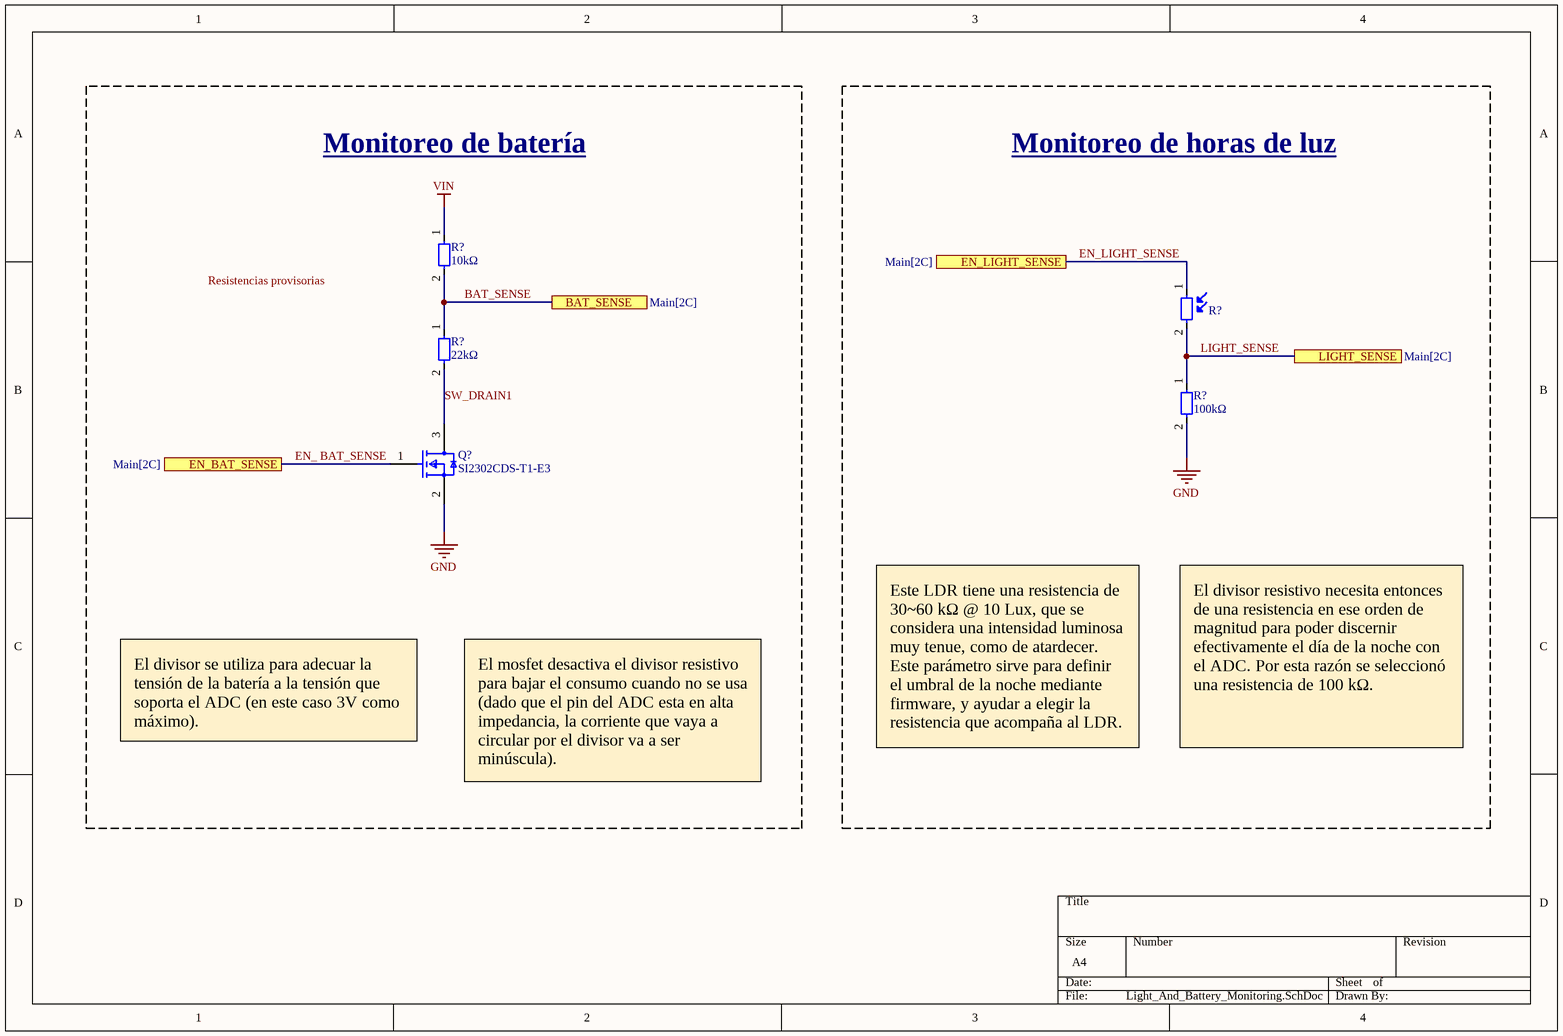
[diagram p6: Light_And_Battery_Monitoring.SchDoc]

### Parts
(Parts that share a designator on the sheet are numbered #1, #2 ... from top to bottom, then left to right.)
Q?  SI2302CDS-T1-E3  [FP-S-03946-MFG]
R?#17  value 10kΩ  [PACKAGE_0805]  (hidden comment: Simbolo de resistencia genérica)
R?#18  Simbolo de LDR genérico  [Generic LDR]  (value not drawn)
R?#19  value 22kΩ  [PACKAGE_0805]  (hidden comment: Simbolo de resistencia genérica)
R?#20  value 100kΩ  [PACKAGE_0805]  (hidden comment: Simbolo de resistencia genérica)

### Blocks framed on the sheet
Monitoreo de batería: Q? R?#17 R?#19
Monitoreo de horas de luz: R?#18 R?#20

### Ports
BAT_SENSE (see Main[2C]), EN_BAT_SENSE (see Main[2C]), EN_LIGHT_SENSE (see Main[2C]), LIGHT_SENSE (see Main[2C])

### Nets
GND: Q?.2(S) R?#20.2
VIN: R?#17.1
BAT_SENSE: R?#17.2 R?#19.1 ; port BAT_SENSE
EN_ BAT_SENSE: Q?.1(G) ; port EN_BAT_SENSE
EN_LIGHT_SENSE: R?#18.1 ; port EN_LIGHT_SENSE
LIGHT_SENSE: R?#18.2 R?#20.1 ; port LIGHT_SENSE
SW_DRAIN1: Q?.3(D) R?#19.2

### Notes on the sheet
- Resistencias provisorias
- El divisor se utiliza para adecuar la tensión de la batería a la tensión que soporta el ADC (en este caso 3V como máximo).
- El mosfet desactiva el divisor resistivo para bajar el consumo cuando no se usa (dado que el pin del ADC esta en alta impedancia, la corriente que vaya a circular por el divisor va a ser minúscula).
- Este LDR tiene una resistencia de 30~60 kΩ @ 10 Lux, que se considera una intensidad luminosa muy tenue, como de atardecer. Este parámetro sirve para definir el umbral de la noche mediante firmware, y ayudar a elegir la resistencia que acompaña al LDR.
- El divisor resistivo necesita entonces de una resistencia en ese orden de magnitud para poder discernir efectivamente el día de la noche con el ADC. Por esta razón se seleccionó una resistencia de 100 kΩ.

### Library data of the parts
Q? = CMP-02550-000184-1: MOSFET N-CH 20V 2.6A SOT-23; Manufacturer: Vishay; Gate To Source Voltage: 8V; Max Forward Diode Voltage: 1.2V; Pulse Drain Current: 10A; Typ Forward Diode Voltage: 0.7V; Number Of N Channels: 1; Reverse Recovery Charge: 2nC; Power Dissipation: 0.71W; Reverse Recovery Time: 8.5ns; Threshold Vgs Min: 0.4V; Drain To Source Resistance: 0.045Ω; Gate Charge At Vgs: 3.5nC @ 4.5V; Turn Off Delay Time: 30ns; Rthja Max: 140°C/W; Max Junction Temp: +150°C; Transconductance: 13S; Depletion Mode: False; Standoff Height: 0.01mm; Turn On Delay Time: 8ns; Threshold Vgs Max: 0.85V; Manufacturer Part Number: SI2302CDS-T1-E3; Mouser Description: MOSFET 20V 2.9A 0.86W 57mohm @ 4.5V; Digikey Description: MOSFET N-CH 20V 2.6A SOT-23; Drain To Source Voltage: 20V; Lead Free: Yes; Temperature Range High: +150°C; Automotive: No; ComponentLink2URL: http://www.vishay.com/docs/68645/si2302cds.pdf; Height: 1.12mm; ComponentLink2Description: Datasheet; Octopart: https://octopart.com/si2302cds-t1-e3-vishay-44452855; Continuous Drain Current: 2.6A; Drain To Source Breakdown Voltage: 20V; Number Of Channels: 1; Device Class L3: MOSFETs; Device Class L1: Discrete Semiconductors; Temperature Range Low: -55°C; Package: S-03946; RoHS: TRUE; Device Class L2: Transistors; Temperature: -55°C to +150°C; Category: Trans
R?#17 R?#19 R?#20 = Generic R
R?#18 = Generic LDR: Light Resistance: 30kΩ - 60 kΩ  @ 10 Lux; Dark Resistance: 10MΩ; Spectral Response Range: 400-700nm; Diameter: 5mm

## Sheet Stem_Diameter_Measurement.SchDoc
size A4; SheetNumber: 8; SheetTotal: 8
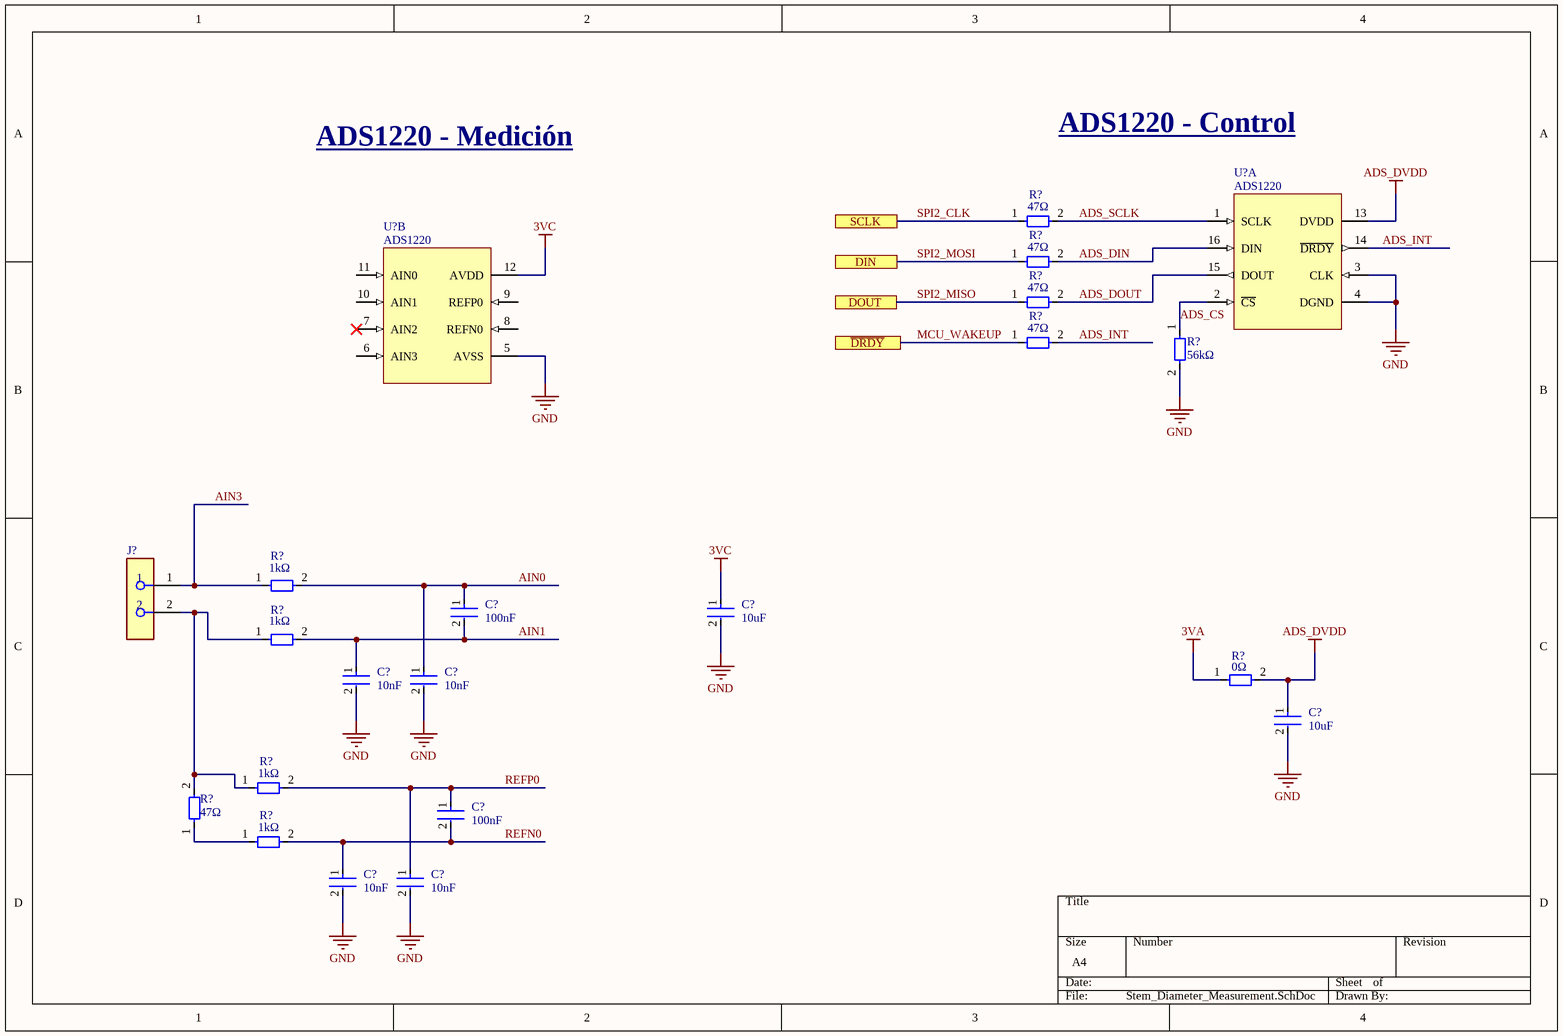
[diagram p7: Stem_Diameter_Measurement.SchDoc]

### Parts
(Parts that share a designator on the sheet are numbered #1, #2 ... from top to bottom, then left to right.)
C?#20  Capacitance: 100nF  [FP-CL21-IPC_B]  (hidden comment: CL21A106KPFNNNE)
C?#21  Capacitance: 10uF  [FP-CL21-IPC_B]  (hidden comment: CL21A106KPFNNNE)
C?#22  Capacitance: 10nF  [FP-CL21-IPC_B]  (hidden comment: CL21A106KPFNNNE)
C?#23  Capacitance: 10nF  [FP-CL21-IPC_B]  (hidden comment: CL21A106KPFNNNE)
C?#24  Capacitance: 10uF  [FP-CL21-IPC_B]  (hidden comment: CL21A106KPFNNNE)
C?#25  Capacitance: 100nF  [FP-CL21-IPC_B]  (hidden comment: CL21A106KPFNNNE)
C?#26  Capacitance: 10nF  [FP-CL21-IPC_B]  (hidden comment: CL21A106KPFNNNE)
C?#27  Capacitance: 10nF  [FP-CL21-IPC_B]  (hidden comment: CL21A106KPFNNNE)
J?#5  PPTC021LGBN-RC  [FP-PPTC021LGBN-RC-MFG]  (value not drawn)
R?#21  value 47Ω  [PACKAGE_0805]  (hidden comment: Simbolo de resistencia genérica)
R?#22  value 47Ω  [PACKAGE_0805]  (hidden comment: Simbolo de resistencia genérica)
R?#23  value 47Ω  [PACKAGE_0805]  (hidden comment: Simbolo de resistencia genérica)
R?#24  value 47Ω  [PACKAGE_0805]  (hidden comment: Simbolo de resistencia genérica)
R?#25  value 56kΩ  [PACKAGE_0805]  (hidden comment: Simbolo de resistencia genérica)
R?#26  value 1kΩ  [PACKAGE_0805]  (hidden comment: Simbolo de resistencia genérica)
R?#27  value 1kΩ  [PACKAGE_0805]  (hidden comment: Simbolo de resistencia genérica)
R?#28  value 0Ω  [PACKAGE_0805]  (hidden comment: Simbolo de resistencia genérica)
R?#29  value 1kΩ  [PACKAGE_0805]  (hidden comment: Simbolo de resistencia genérica)
R?#30  value 47Ω  [PACKAGE_0805]  (hidden comment: Simbolo de resistencia genérica)
R?#31  value 1kΩ  [PACKAGE_0805]  (hidden comment: Simbolo de resistencia genérica)
U?#9  ADS1220  [TSSOP-16]  (part A of 2)
U?#10  ADS1220  [TSSOP-16]  (part B of 2)

### Ports
DIN, DOUT, SCLK, ~{DRDY}

### Nets
3VA: R?#28.1
3VC: C?#21.1 U?#10.12(AVDD)
ADS_DVDD: C?#24.1 R?#28.2 U?#9.13(DVDD)
GND: C?#21.2 C?#22.2 C?#23.2 C?#24.2 C?#26.2 C?#27.2 R?#25.2 U?#9.3(CLK) U?#9.4(DGND) U?#10.5(AVSS)
ADS_CS: R?#25.1 U?#9.2(~{CS})
ADS_DIN: R?#22.2 U?#9.16(DIN)
ADS_DOUT: R?#23.2 U?#9.15(DOUT)
ADS_INT: R?#24.2 U?#9.14(~{DRDY})
ADS_SCLK: R?#21.2 U?#9.1(SCLK)
AIN0: C?#20.1 C?#23.1 R?#26.2
AIN1: C?#20.2 C?#22.1 R?#27.2
AIN3: J?#5.1 R?#26.1
MCU_WAKEUP: R?#24.1 ; port ~{DRDY}
REFN0: C?#25.2 C?#26.1 R?#31.2
REFP0: C?#25.1 C?#27.1 R?#29.2
SPI2_CLK: R?#21.1 ; port SCLK
SPI2_MISO: R?#23.1 ; port DOUT
SPI2_MOSI: R?#22.1 ; port DIN
NetJ?#5_2: J?#5.2 R?#27.1 R?#29.1 R?#30.2
NetR?#30_1: R?#30.1 R?#31.1

Not connected (* = marked no-connect by the designer): U?#10 6(AIN3) 7(AIN2)* 8(REFN0) 9(REFP0) 10(AIN1) 11(AIN0)

### Notes on the sheet
- ADS1220 - Medición
- ADS1220 - Control

### Library data of the parts
C?#20-C?#27 = CMP-2000-06103-2: as C?#3 on sheet Micro_Essentials; Case Code (Imperial): 0805; Mount: Surface Mount; Depth: 1.25mm; Length: 2mm; Lead Free: Lead Free; Packaging: Tape and Reel; Dielectric: X5R; Width: 0.049inch; Package Quantity: 1; Height: 1.25mm; Case/Package: 0805; Voltage Rating: 10V; Thickness: 0.053inch; Max Operating Temperature: 85°C; Tolerance: 10%; Case Code (Metric): 2012; Contact Plating: Tin; Min Operating Temperature: -55°C; Radiation Hardening: No; Voltage Rating (DC): 10V
J?#5 = CMP-00595-00270342-1: PPTC021LGBN-RC 2 Position Total Single Row 2.54 mm Pitch Right Angle Female Header; NexarPartId: 270342; Pitch: 2.54mm; Current Rating: 3A; Number of Positions: 2; Voltage Rating: 250V; Connector Type: Header, Socket; Lead Free: Lead Free; Height: 2.4mm; Contact Material: Bronze, Nickel, Tin; Color: Black; RoHS: Compliant; Width: 8.5mm; Min Operating Temperature: -40°C; Housing Color: Black; Max Operating Temperature: 105°C; Termination: Solder; Mount: Through Hole; Packaging: Bulk; Contact Plating: Tin; Number of Rows: 1; Housing Material: Plastic; Length: 5.58mm; Number of Contacts: 2
R?#21-R?#31 = Generic R
U?#9 U?#10 = ADS1220: ADS1220 4-Channel, 2-kSPS, Low-Power, 24-Bit ADC with Integrated PGA and Reference

## Nets that join several sheets
+3V: Micro_Essentials (14 pins), Supply_Voltage (C?#13.1 U?#3.5), I2C_Devices (6 pins), SD_Card (7 pins), BLE_Module (R?#14.1 R?#15.1 R?#16.1)
GND: Micro_Essentials (20 pins), Supply_Voltage (10 pins), I2C_Devices (12 pins), SD_Card (5 pins), BLE_Module (5 pins), Light_And_Battery_Monitoring (Q?.2 R?#20.2), Stem_Diameter_Measurement (10 pins)
VIN: Supply_Voltage (6 pins), Light_And_Battery_Monitoring (R?#17.1)